# Altium schematic sheet ESP32.SchDoc
size A4; SheetNumber: 2; SheetTotal: 3
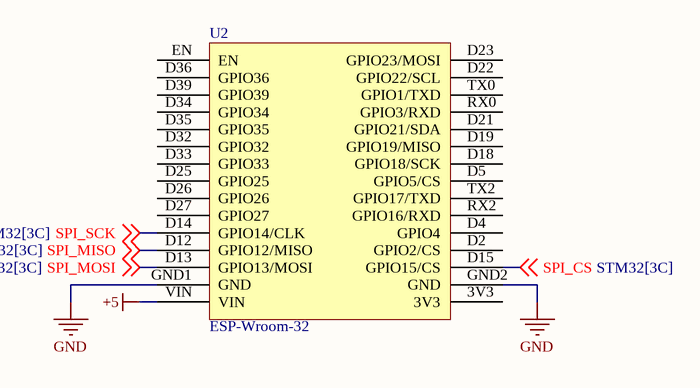
[diagram p0: ESP32.SchDoc]

## Parts
U2  ESP-Wroom-32  [MODULE_ESP32_DEVKIT_V1]

## Nets
+5: U2.VIN
GND: U2.GND1(GND) U2.GND2(GND)
SPI_CS: U2.D15(GPIO15/CS) ; off-sheet SPI_CS
SPI_MISO: U2.D12(GPIO12/MISO) ; off-sheet SPI_MISO
SPI_MOSI: U2.D13(GPIO13/MOSI) ; off-sheet SPI_MOSI
SPI_SCK: U2.D14(GPIO14/CLK) ; off-sheet SPI_SCK

Not connected (* = marked no-connect by the designer): U2 3V3 D2(GPIO2/CS) D4(GPIO4) D5(GPIO5/CS) D18(GPIO18/SCK) D19(GPIO19/MISO) D21(GPIO21/SDA) D22(GPIO22/SCL) D23(GPIO23/MOSI) D25(GPIO25) D26(GPIO26) D27(GPIO27) D32(GPIO32) D33(GPIO33) D34(GPIO34) D35(GPIO35) D36(GPIO36) D39(GPIO39) EN RX0(GPIO3/RXD) RX2(GPIO16/RXD) TX0(GPIO1/TXD) TX2(GPIO17/TXD)

## Library data of the parts
U2 = ESP-Wroom-32: https://lastminuteengineers.com/esp32-pinout-reference/; pin to pad: 3V3>16 D2>19 D4>20 D5>23 D12>12 D13>13 D14>11 D15>18 D18>24 D19>25 D21>26 D22>29 D23>30 D25>8 D26>9 D27>10 D32>6 D33>7 D34>4 D35>5 D36>2 D39>3 EN>1 GND1>14 GND2>17 RX0>27 RX2>21 TX0>28 TX2>22 VIN>15